# Altium schematic sheet [04] - Current Transformers.SchDoc
size A3
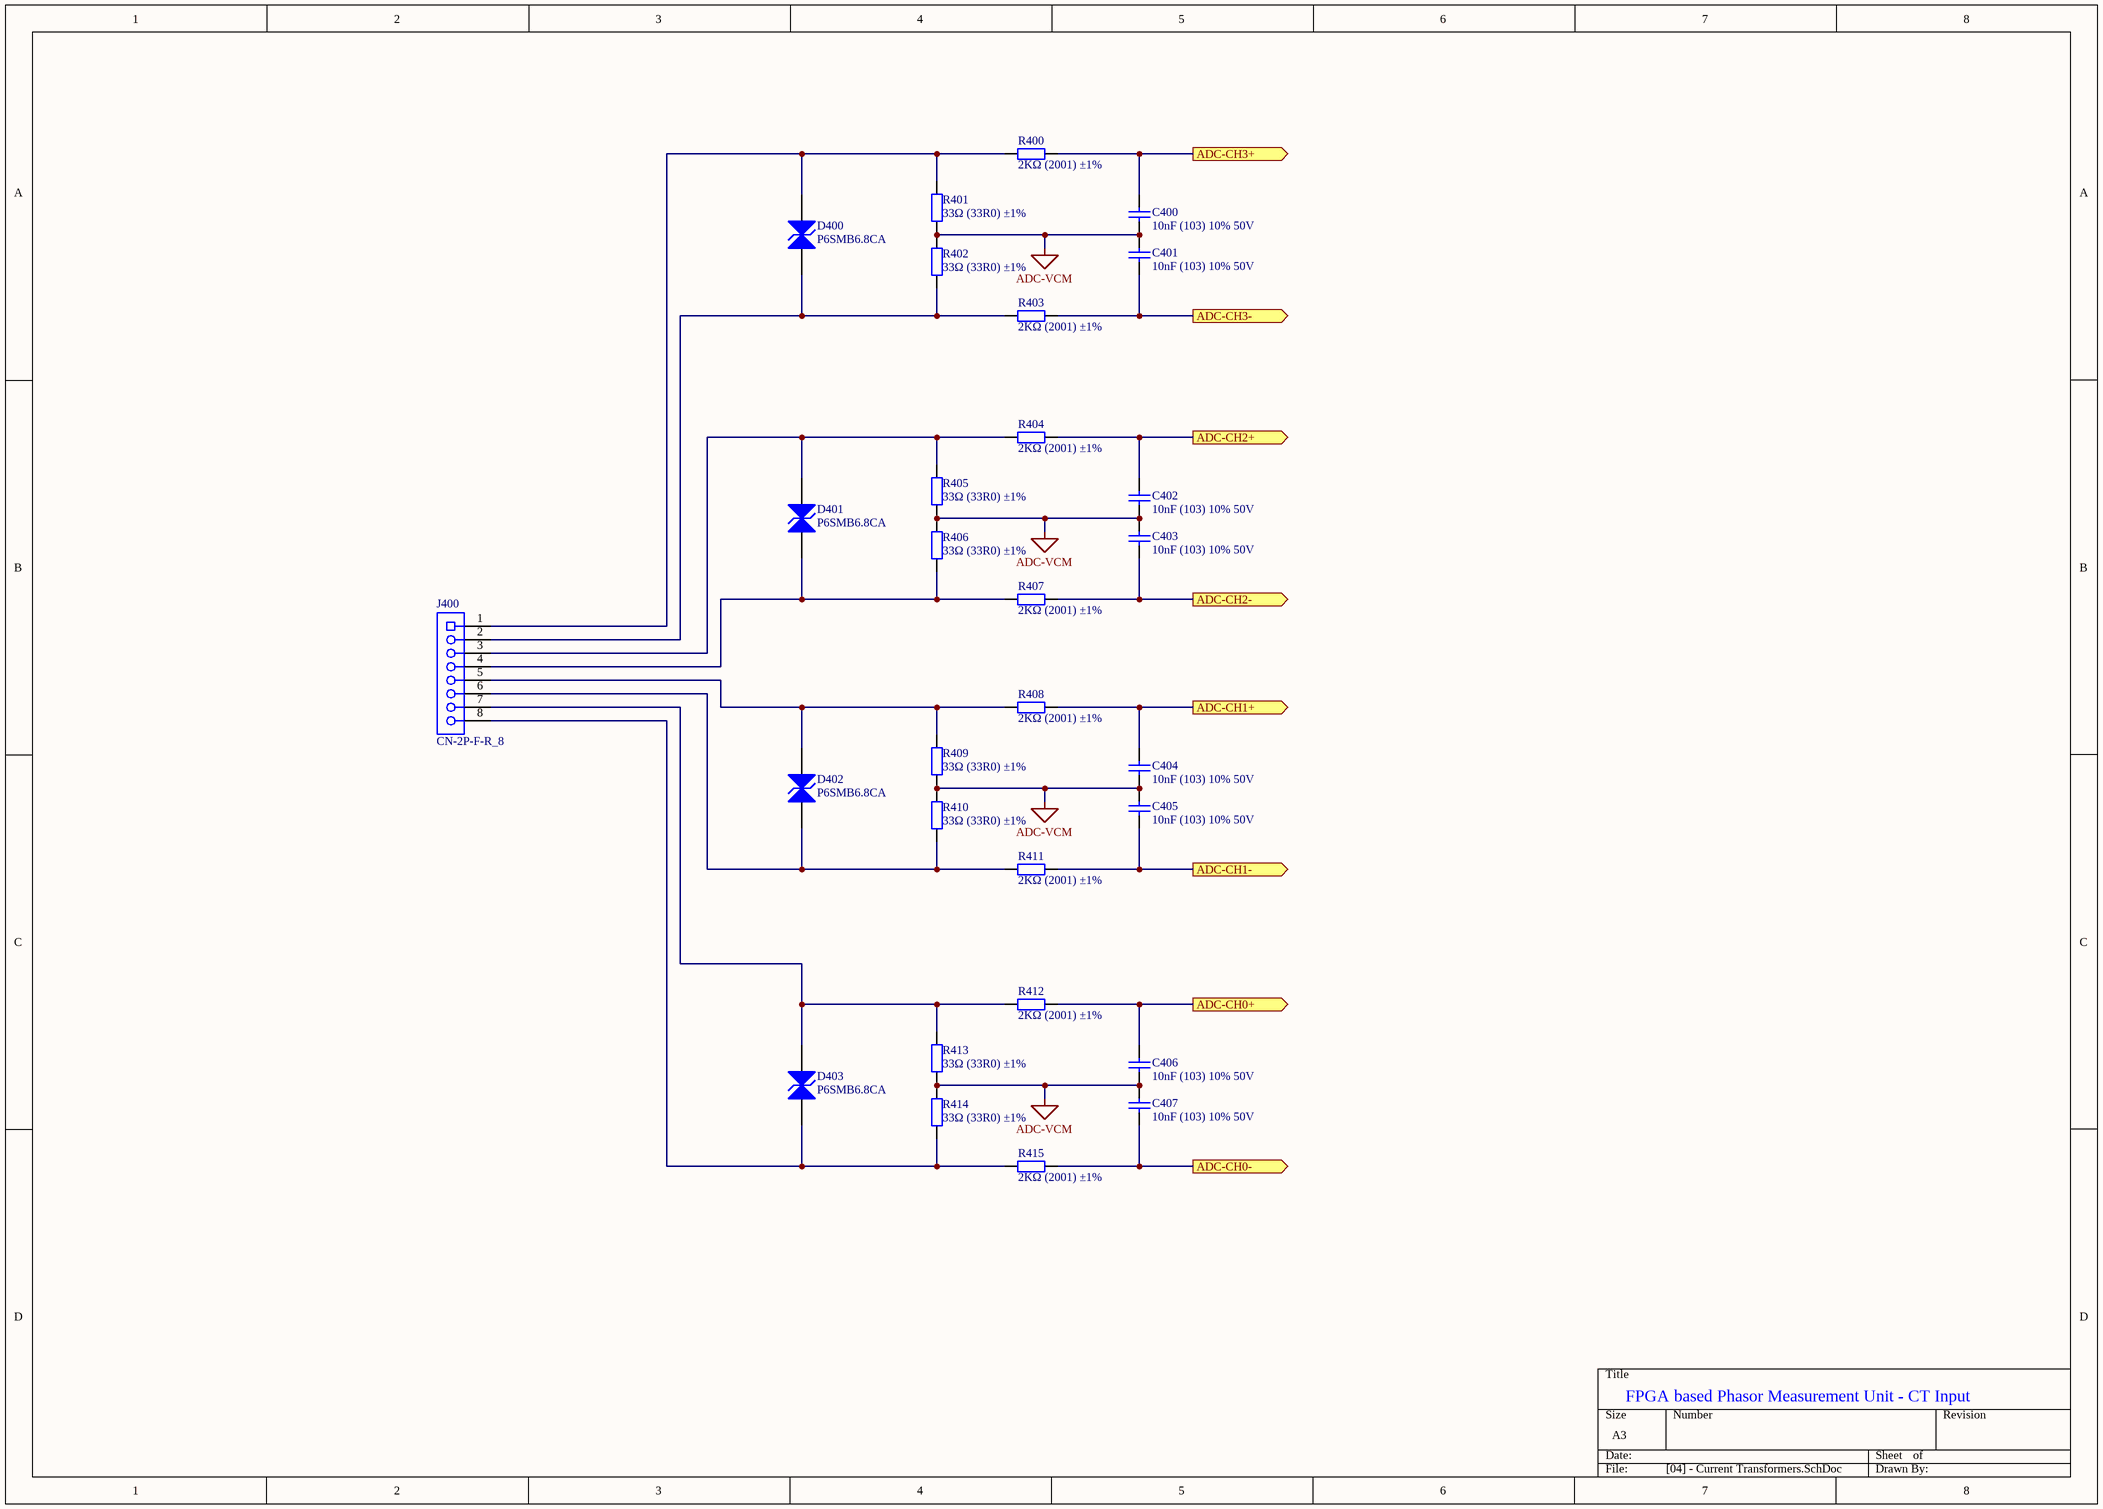
[diagram p0: [04] - Current Transformers.SchDoc]

## Parts
C400  10nF (103) 10% 50V  [0805_C]
C401  10nF (103) 10% 50V  [0805_C]
C402  10nF (103) 10% 50V  [0805_C]
C403  10nF (103) 10% 50V  [0805_C]
C404  10nF (103) 10% 50V  [0805_C]
C405  10nF (103) 10% 50V  [0805_C]
C406  10nF (103) 10% 50V  [0805_C]
C407  10nF (103) 10% 50V  [0805_C]
D400  P6SMB6.8CA  [SMB(DO-214AA)_S1]
D401  P6SMB6.8CA  [SMB(DO-214AA)_S1]
D402  P6SMB6.8CA  [SMB(DO-214AA)_S1]
D403  P6SMB6.8CA  [SMB(DO-214AA)_S1]
J400  CN-2P-F-R_8  [PHOE-8way]
R400  2KΩ (2001) ±1%  [0805_R]
R401  33Ω (33R0) ±1%  [0603_R]
R402  33Ω (33R0) ±1%  [0603_R]
R403  2KΩ (2001) ±1%  [0805_R]
R404  2KΩ (2001) ±1%  [0805_R]
R405  33Ω (33R0) ±1%  [0603_R]
R406  33Ω (33R0) ±1%  [0603_R]
R407  2KΩ (2001) ±1%  [0805_R]
R408  2KΩ (2001) ±1%  [0805_R]
R409  33Ω (33R0) ±1%  [0603_R]
R410  33Ω (33R0) ±1%  [0603_R]
R411  2KΩ (2001) ±1%  [0805_R]
R412  2KΩ (2001) ±1%  [0805_R]
R413  33Ω (33R0) ±1%  [0603_R]
R414  33Ω (33R0) ±1%  [0603_R]
R415  2KΩ (2001) ±1%  [0805_R]

## Ports
ADC-CH0+ (out), ADC-CH0- (out), ADC-CH1+ (out), ADC-CH1- (out), ADC-CH2+ (out), ADC-CH2- (out), ADC-CH3+ (out), ADC-CH3- (out)

## Nets
ADC-VCM: C400.1 C401.2 C402.1 C403.2 C404.1 C405.2 C406.1 C407.2 R401.1 R402.2 R405.1 R406.2 R409.1 R410.2 R413.1 R414.2
ADC-CH0+: C406.2 R412.1 ; port ADC-CH0+
ADC-CH0-: C407.1 R415.1 ; port ADC-CH0-
ADC-CH1+: C404.2 R408.1 ; port ADC-CH1+
ADC-CH1-: C405.1 R411.1 ; port ADC-CH1-
ADC-CH2+: C402.2 R404.1 ; port ADC-CH2+
ADC-CH2-: C403.1 R407.1 ; port ADC-CH2-
ADC-CH3+: C400.2 R400.1 ; port ADC-CH3+
ADC-CH3-: C401.1 R403.1 ; port ADC-CH3-
NetD400_1: D400.1(A) J400.2 R402.1 R403.2
NetD400_2: D400.2(K) J400.1 R400.2 R401.2
NetD401_1: D401.1(A) J400.4 R406.1 R407.2
NetD401_2: D401.2(K) J400.3 R404.2 R405.2
NetD402_1: D402.1(A) J400.6 R410.1 R411.2
NetD402_2: D402.2(K) J400.5 R408.2 R409.2
NetD403_1: D403.1(A) J400.8 R414.1 R415.2
NetD403_2: D403.2(K) J400.7 R412.2 R413.2

## Notes on the sheet
- FPGA based Phasor Measurement Unit - CT Input

## Library data of the parts
C400-C407 = 0805 10nF (103) 10% 50V: 贴片电容; ComponentLink1Description: 供应商链接; ComponentLink1URL: http://www.szlcsc.com/product/details_2062.html; Package: 0805; Supplier: LC; SuppliersPartNumber: C1710
D400-D403 = SMB/DO-214AA P6SMB6.8CA: TVS; ComponentLink1Description: 供应商链接; ComponentLink1URL: http://www.szlcsc.com/product/details_79530.html; Package: SMB/DO-214AA; Supplier: LC; SuppliersPartNumber: C78395
J400 = CN-2P-F-R_8: 8way - 5.08 block; JLCPCB: NO
R400 R403 R404 R407 R408 R411 R412 R415 = 0805 2KΩ (2001) 1%: 贴片电阻; ComponentLink1Description: 供应商链接; ComponentLink1URL: http://www.szlcsc.com/product/details_18292.html; Package: 0805; Supplier: LC; SuppliersPartNumber: C17604
R401 R402 R405 R406 R409 R410 R413 R414 = 0603 33Ω (33R0) 1%: 贴片电阻; ComponentLink1Description: 供应商链接; ComponentLink1URL: http://www.szlcsc.com/product/details_23867.html; Package: 0603; Supplier: LC; SuppliersPartNumber: C23140